# Altium project DAPLink.PrjPCB
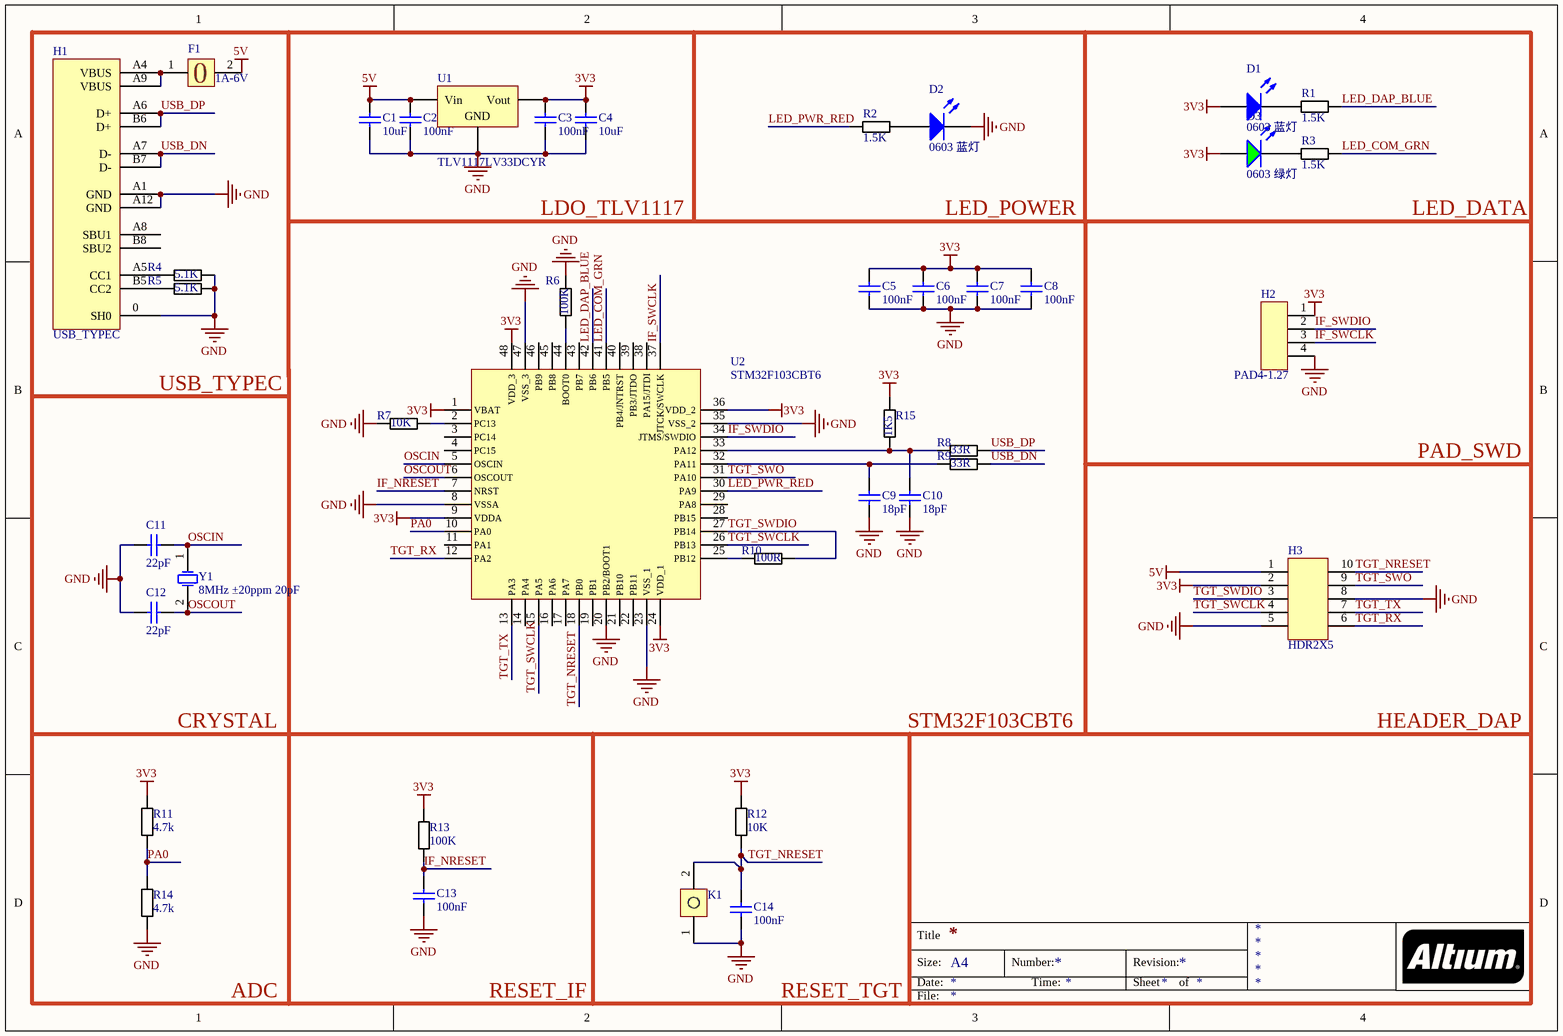
[diagram p0: DAPLink.SchDoc]
1 sheet, 40 parts. Net scope: global (net labels, ports and power ports of the same name join across sheets).
Board file: DAPLink.PcbDoc

## Sheet DAPLink.SchDoc
size A4

### Parts
C1  10uF  [0603_C]
C2  100nF  [0603_C]
C3  100nF  [0603_C]
C4  10uF  [0603_C]
C5  100nF  [0603_C]
C6  100nF  [0603_C]
C7  100nF  [0603_C]
C8  100nF  [0603_C]
C9  18pF  [0603_C]
C10  18pF  [0603_C]
C11  22pF  [0603_C]
C12  22pF  [0603_C]
C13  100nF  [0603_C]
C14  100nF  [0603_C]
D1  0603 蓝灯  [0603_LED_BLUE]
D2  0603 蓝灯  [0603_LED_BLUE]
D3  0603 绿灯  [0603_LED_GREEN]
F1  1A-6V  [0805_FUSE]
H1  USB_TYPEC  [USB_TYPEC]
H2  PAD4-1.27  [HDR4-1.27]
H3  HDR2X5  [HDR2X5_2.54_180H]
K1  BUTTON_MINI  [BUTTON_MINI]  (value not drawn)
R1  1.5K  [0603_R]
R2  1.5K  [0603_R]
R3  1.5K  [0603_R]
R4  5.1K  [0603_R]
R5  5.1K  [0603_R]
R6  100K  [0603_R]
R7  10K  [0603_R]
R8  33R  [0603_R]
R9  33R  [0603_R]
R10  100R  [0603_R]
R11  4.7k  [0603_R]
R12  10K  [0603_R]
R13  100K  [0603_R]
R14  4.7k  [0603_R]
R15  1K5  [0603_R]
U1  TLV1117LV33DCYR  [SOT-223]
U2  STM32F103CBT6  [LQFP-48_7x7x05P]
Y1  8MHz ±20ppm 20pF  [SMD-5032_2P]

### Nets
3V3: C3.2 C4.2 C5.2 C6.2 C7.2 C8.2 D1.A D3.A H2.1 H3.2 R11.2 R12.2 R13.2 R15.2 U1.2(Vout) U2.1(VBAT) U2.9(VDDA) U2.24(VDD_1) U2.36(VDD_2) U2.48(VDD_3)
5V: C1.2 C2.2 F1.2 H3.1 U1.3(Vin)
GND: C1.1 C2.1 C3.1 C4.1 C5.1 C6.1 C7.1 C8.1 C9.1 C10.1 C11.1 C12.1 C13.1 C14.1 D2.K H1.0(SH0) H1.A1(GND) H1.A12(GND) H2.4 H3.5 H3.8 K1.1 R4.2 R5.2 R6.2 R7.1 R14.1 U1.1(GND) U2.8(VSSA) U2.20(PB2/BOOT1) U2.23(VSS_1) U2.35(VSS_2) U2.47(VSS_3)
IF_NRESET: C13.2 R13.1 U2.7(NRST)
IF_SWCLK: H2.3 U2.37(JTCK/SWCLK)
IF_SWDIO: H2.2 U2.34(JTMS/SWDIO)
LED_COM_GRN: R3.2 U2.41(PB5)
LED_DAP_BLUE: R1.2 U2.42(PB6)
LED_PWR_RED: R2.1 U2.30(PA9)
OSCIN: C11.2 U2.5(OSCIN) Y1.1(OSC1)
OSCOUT: C12.2 U2.6(OSCOUT) Y1.2(OSC2)
PA0: R11.1 R14.2 U2.10(PA0)
TGT_NRESET: C14.2 H3.10 K1.2 R12.1 U2.18(PB0)
TGT_RX: H3.6 U2.12(PA2)
TGT_SWCLK: H3.4 U2.15(PA5) U2.26(PB13)
TGT_SWDIO: H3.3 R10.2 U2.27(PB14)
TGT_SWO: H3.9 U2.31(PA10)
TGT_TX: H3.7 U2.13(PA3)
USB_DN: H1.A7(D-) H1.B7(D-) R9.2
USB_DP: H1.A6(D+) H1.B6(D+) R8.2
NetC9_2: C9.2 R9.1 U2.32(PA11)
NetC10_2: C10.2 R8.1 R15.1 U2.33(PA12)
NetD1_K: D1.K R1.1
NetD2_A: D2.A R2.2
NetD3_K: D3.K R3.1
NetF1_1: F1.1 H1.A4(VBUS) H1.A9(VBUS)
NetH1_A5: H1.A5(CC1) R4.1
NetH1_B5: H1.B5(CC2) R5.1
NetR6_1: R6.1 U2.44(BOOT0)
NetR7_2: R7.2 U2.2(PC13)
NetR10_1: R10.1 U2.25(PB12)

Not connected (* = marked no-connect by the designer): H1 A8(SBU1) B8(SBU2); U2 3(PC14) 4(PC15) 11(PA1) 14(PA4) 16(PA6) 17(PA7) 19(PB1) 21(PB10) 22(PB11) 28(PB15) 29(PA8) 38(PA15/JTDI) 39(PB3/JTDO) 40(PB4/JNTRST) 43(PB7) 45(PB8) 46(PB9)

### Notes on the sheet
- LDO_TLV1117
- LED_POWER
- LED_DATA
- USB_TYPEC
- PAD_SWD
- CRYSTAL
- STM32F103CBT6
- HEADER_DAP
- ADC
- RESET_IF
- RESET_TGT
- Title
- Size:
- Date:
- A4
- Number:
- Time:
- Revision:
- Sheet
- of
- File:
- (in symbol FUSE-0805) 0

### Library data of the parts
C1 C4 = CAP-0603: 0603贴片电容 10UF(106) ±20% 25V; ComponentLink1Description: 供应商链接; ComponentLink1URL: http://www.szlcsc.com/product/details_1921.html; Package: 0402; Supplier: LC; SuppliersPartNumber: C1569
C2 C3 C5-C8 C13 C14 = CAP-0603: 0603贴片电容 100NF (104) ±10% 50V X7R; ComponentLink1Description: 供应商链接; ComponentLink1URL: http://www.szlcsc.com/product/details_1921.html; Package: 0402; Supplier: LC; SuppliersPartNumber: C1569
C9 C10 = CAP-0603: 0603贴片电容 18PF (180) ±5% 50V C0G; ComponentLink1Description: 供应商链接; ComponentLink1URL: http://www.szlcsc.com/product/details_1921.html; Package: 0402; Supplier: LC; SuppliersPartNumber: C1569
C11 C12 = CAP-0603: 0603 贴片电容 22PF (220) ±5% 50V C0G; ComponentLink1Description: 供应商链接; ComponentLink1URL: http://www.szlcsc.com/product/details_1921.html; Package: 0402; Supplier: LC; SuppliersPartNumber: C1569
D1 D2 = 0603 蓝灯: 发光二极管; ComponentLink1Description: 供应商链接; ComponentLink1URL: http://www.szlcsc.com/product/details_73150.html; Package: 0603; Supplier: LC; SuppliersPartNumber: C72041
D3 = 0603 绿灯: 发光二极管; ComponentLink1Description: 供应商链接; ComponentLink1URL: http://www.szlcsc.com/product/details_73152.html; Package: 0603; Supplier: LC; SuppliersPartNumber: C72043
F1 = FUSE-0805: 0805 1A 6V自恢复保险丝 SMD0805-100
H3 = HDR2X5_2.54_180H: 2.54双排排针
K1 = BUTTON_MINI: 微动按键 龟仔
R1-R15 = RES-0603
U1 = TLV1117LV33DCYR: 低压差线性稳压(LDO); ComponentLink1Description: 供应商链接; ComponentLink1URL: http://www.szlcsc.com/product/details_6652.html; Package: SOT-223; Supplier: LC; SuppliersPartNumber: C6186
U2 = STM32F103CBT6: STM32F103CBT6   LQFP-48
Y1 = SMD-5032_2P 8MHz 20ppm 20pF: 5032贴片晶振，8MHz 20pF; ComponentLink1Description: 供应商链接; ComponentLink1URL: http://www.szlcsc.com/product/details_117214.html; Package: SMD-5032_2P; Supplier: LC; SuppliersPartNumber: C115962